# EAGLE design BallLamp (EAGLE 7.5.0)
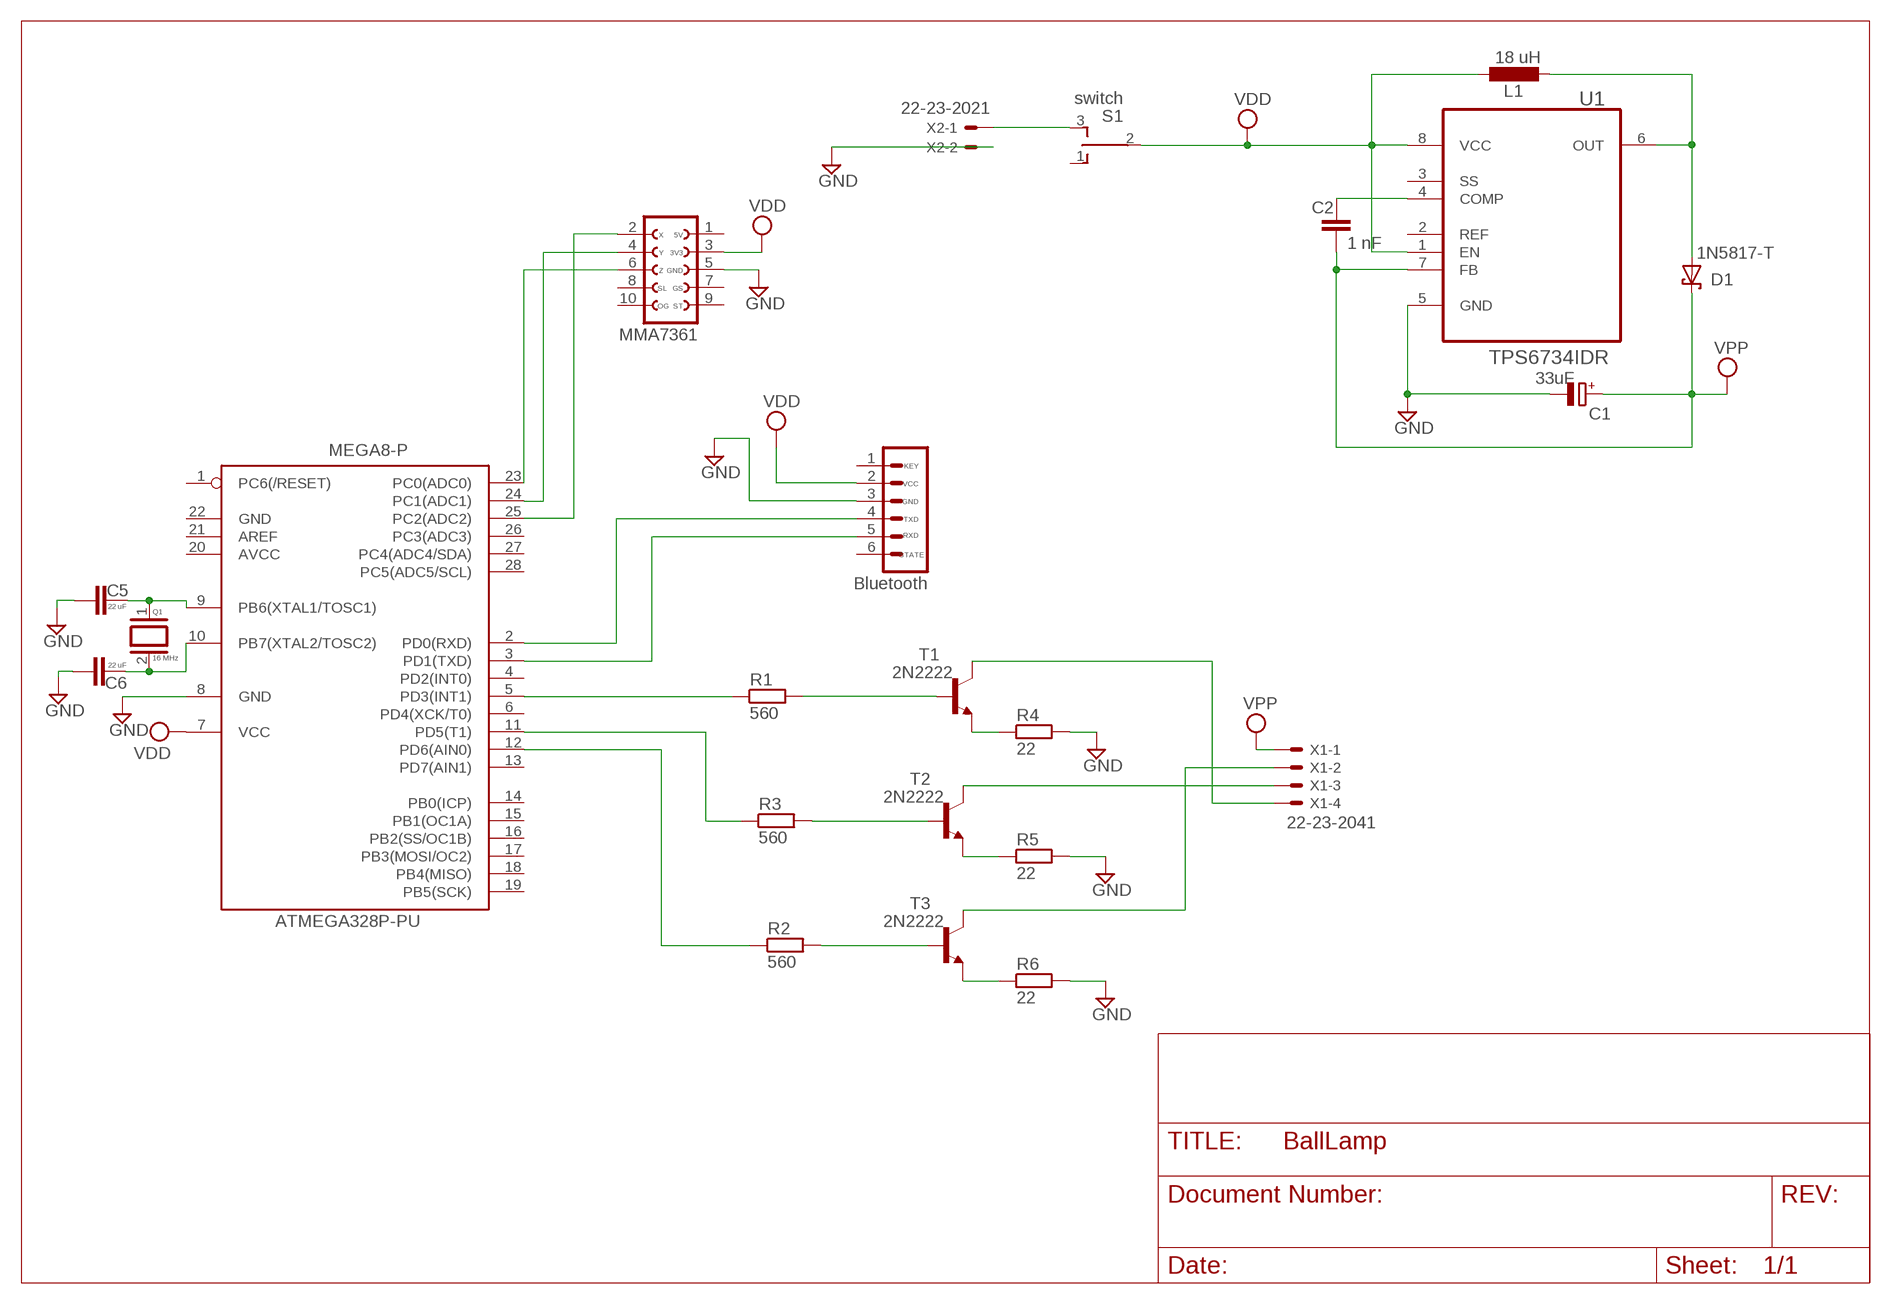
[diagram p0: schematic, sheet 1]

## Parts
ATMEGA328P-PU  MEGA8-P  [DIL28-3]
BLUETOOTH  M06  [06P]
C1  33uF  CPOL-EUE5-5  [E5-5]
C2  1 nF  C-EU025-025X050  [C025-025X050]
C5  22 uF  C-EU050-024X044  [C050-024X044]
C6  22 uF  C-EU050-024X044  [C050-024X044]
D1  1N5817-T  [DO41-7.6]
L1  18 uH  L-EU0207/10  [0207/10]
Q1  16 MHz  XTAL/S  [QS]
R1  560  R-EU_0207/10  [0207/10]
R2  560  R-EU_0207/10  [0207/10]
R3  560  R-EU_0207/10  [0207/10]
R4  22  R-EU_0207/10  [0207/10]
R5  22  R-EU_0207/10  [0207/10]
R6  22  R-EU_0207/10  [0207/10]
S1  switch  TL39PO  [TL3XPO]
SV1  FE05-2  [FE05-2]
T1  2N2222  [TO18]
T2  2N2222  [TO18]
T3  2N2222  [TO18]
U1  TPS6734IDR  [SOIC127P600X175-8N]
X1  22-23-2041  [22-23-2041]
X2  22-23-2021  [22-23-2021]

## Nets
+12V: C1.+ C2.2 D1.C U1.7(FB) X1.1 ; supply symbol labelled VPP
GND: ATMEGA328P-PU.8(GND) BLUETOOTH.3 C1.- C5.1 C6.1 R4.2 R5.2 R6.2 SV1.5(GND) U1.5(GND) X2.2
N$1: ATMEGA328P-PU.2(PD0(RXD)) BLUETOOTH.4
N$2: ATMEGA328P-PU.3(PD1(TXD)) BLUETOOTH.5
N$3: ATMEGA328P-PU.23(PC0(ADC0)) SV1.6(Z)
N$4: ATMEGA328P-PU.24(PC1(ADC1)) SV1.4(Y)
N$5: ATMEGA328P-PU.25(PC2(ADC2)) SV1.2(X)
N$6: ATMEGA328P-PU.5(PD3(INT1)) R1.1
N$7: ATMEGA328P-PU.12(PD6(AIN0)) R2.1
N$8: ATMEGA328P-PU.11(PD5(T1)) R3.1
N$9: R1.2 T1.2(B)
N$10: R3.2 T2.2(B)
N$11: R6.1 T3.1(E)
N$12: R2.2 T3.2(B)
N$13: R5.1 T2.1(E)
N$14: R4.1 T1.1(E)
N$15: T1.3(C) X1.4
N$16: T3.3(C) X1.2
N$17: T2.3(C) X1.3
N$19: D1.A L1.2 U1.6(OUT)
N$20: S1.3(S) X2.1
N$21: C2.1 U1.4(COMP)
N$22: ATMEGA328P-PU.10(PB7(XTAL2/TOSC2)) C6.2 Q1.2
N$23: ATMEGA328P-PU.9(PB6(XTAL1/TOSC1)) C5.2 Q1.1
VDD: ATMEGA328P-PU.7(VCC) BLUETOOTH.2 L1.1 S1.2(P) SV1.3(3V3) U1.1(EN) U1.8(VCC)
Unconnected: ATMEGA328P-PU.1(PC6(/RESET)) ATMEGA328P-PU.4(PD2(INT0)) ATMEGA328P-PU.6(PD4(XCK/T0)) ATMEGA328P-PU.13(PD7(AIN1)) ATMEGA328P-PU.14(PB0(ICP)) ATMEGA328P-PU.15(PB1(OC1A)) ATMEGA328P-PU.16(PB2(SS/OC1B)) ATMEGA328P-PU.17(PB3(MOSI/OC2)) ATMEGA328P-PU.18(PB4(MISO)) ATMEGA328P-PU.19(PB5(SCK)) ATMEGA328P-PU.21(AREF) ATMEGA328P-PU.26(PC3(ADC3)) ATMEGA328P-PU.27(PC4(ADC4/SDA)) ATMEGA328P-PU.28(PC5(ADC5/SCL)) BLUETOOTH.1 BLUETOOTH.6 S1.1(O) SV1.1(5V) SV1.7(GS) SV1.8(SL) SV1.9(ST) SV1.10(OG) U1.2(REF) U1.3(SS)

## Power pins joined to a net without a drawn wire
AVCC: ATMEGA328P-PU.20(AVCC)
GND: ATMEGA328P-PU.22(GND)

## Library data of the parts
ATMEGA328P-PU = atmel:MEGA8-P: MICROCONTROLLER 8 Kbytes FLASH, 1 kbytes SRAM, 512 bytes EEPROM, USART, 4-channel 10 bit ADC, 2-channel 8 bit ADC Pin compatible with Atmega48, ATMega88, ATMega168 Source: avr.lbr; OC_FARNELL: unknown; OC_NEWARK: unknown
BLUETOOTH = Bluetooth:M06: AMP QUICK CONNECTOR; OC_FARNELL: unknown; OC_NEWARK: unknown
C1 = rcl:CPOL-EU: POLARIZED CAPACITOR, European symbol
C2 C5 C6 = rcl:C-EU: CAPACITOR, European symbol
D1 = diode:1N581*: 1.0A SCHOTTKY BARRIER RECTIFIER Source: http://www.diodes.com/datasheets/ds23001.pdf
L1 = rcl:L-EU: INDUCTOR, European symbol
Q1 = special:XTAL/S: CRYSTAL
R1-R6 = resistor:R-EU_: RESISTOR, European symbol
S1 = switch:TL39PO: TINY SWITCH ON OFF ON Source: http://www2.produktinfo.conrad.com/datenblaetter/700000-724999/705152-da-01-de-Subminiaturschalter_TL_36YO.pdf
SV1 = con-lsta:FE05-2: FEMALE HEADER; OC_FARNELL: unknown; OC_NEWARK: unknown
T1-T3 = transistor:2N2222: NPN TRANSISTOR
U1 = TI-TPS6734IDR:TPS6734IDR: BOOST-CONVERTER SUPPLY; MPN: TPS6734IDR; OC_FARNELL: 1575732; OC_NEWARK: 77C0735; PACKAGE: SOIC-8; SUPPLIER: Texas Instruments
X1 = con-molex:22-23-2041: .100" (2.54mm) Center Header - 4 Pin; MF: MOLEX; MPN: 22-23-2041; OC_FARNELL: 1462920; OC_NEWARK: 38C0355
X2 = con-molex:22-23-2021: .100" (2.54mm) Center Header - 2 Pin; MF: MOLEX; MPN: 22-23-2021; OC_FARNELL: 1462926; OC_NEWARK: 25C3832

## Board
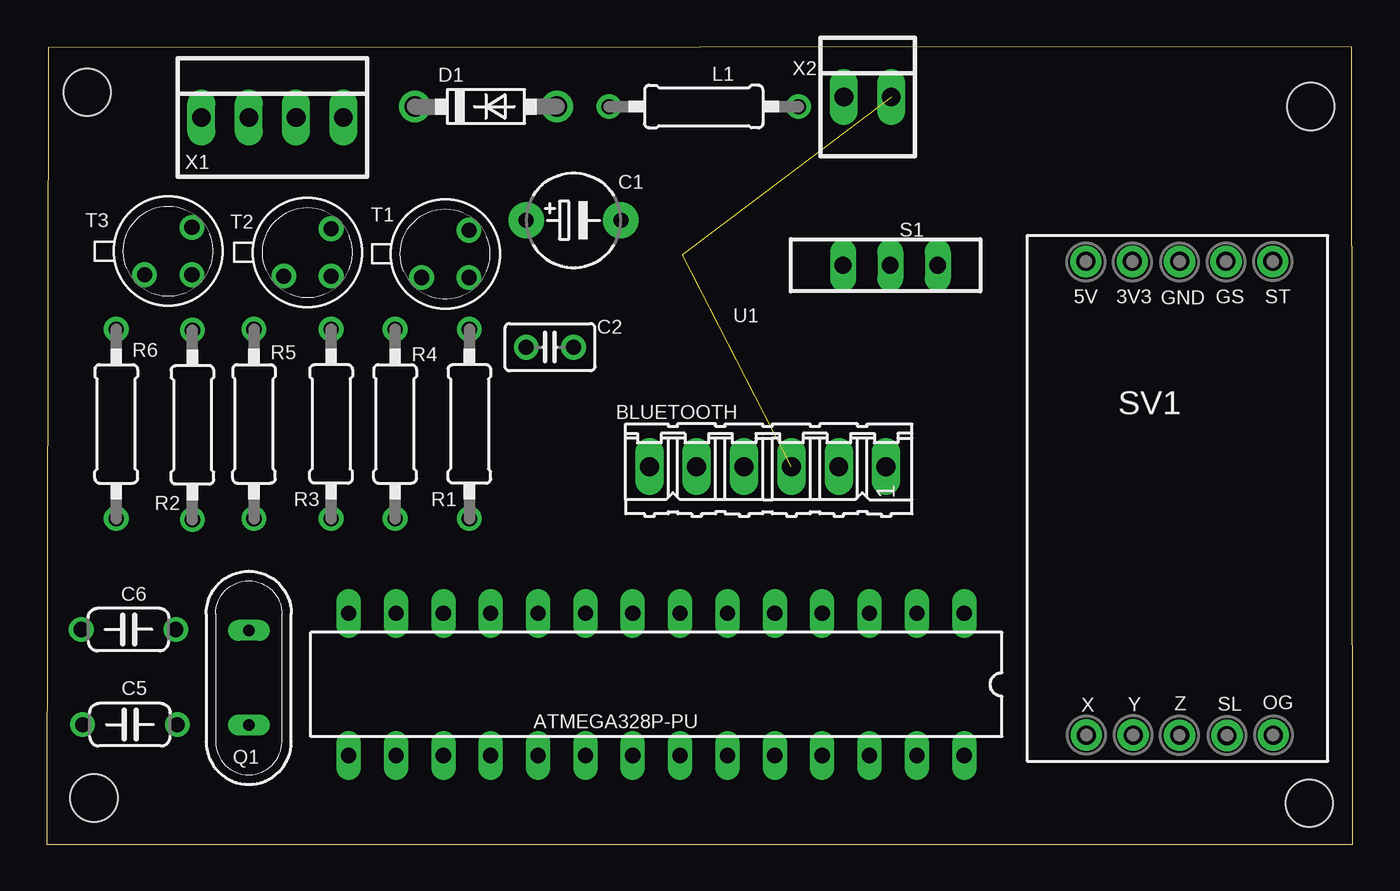
[diagram p1: board, top side]
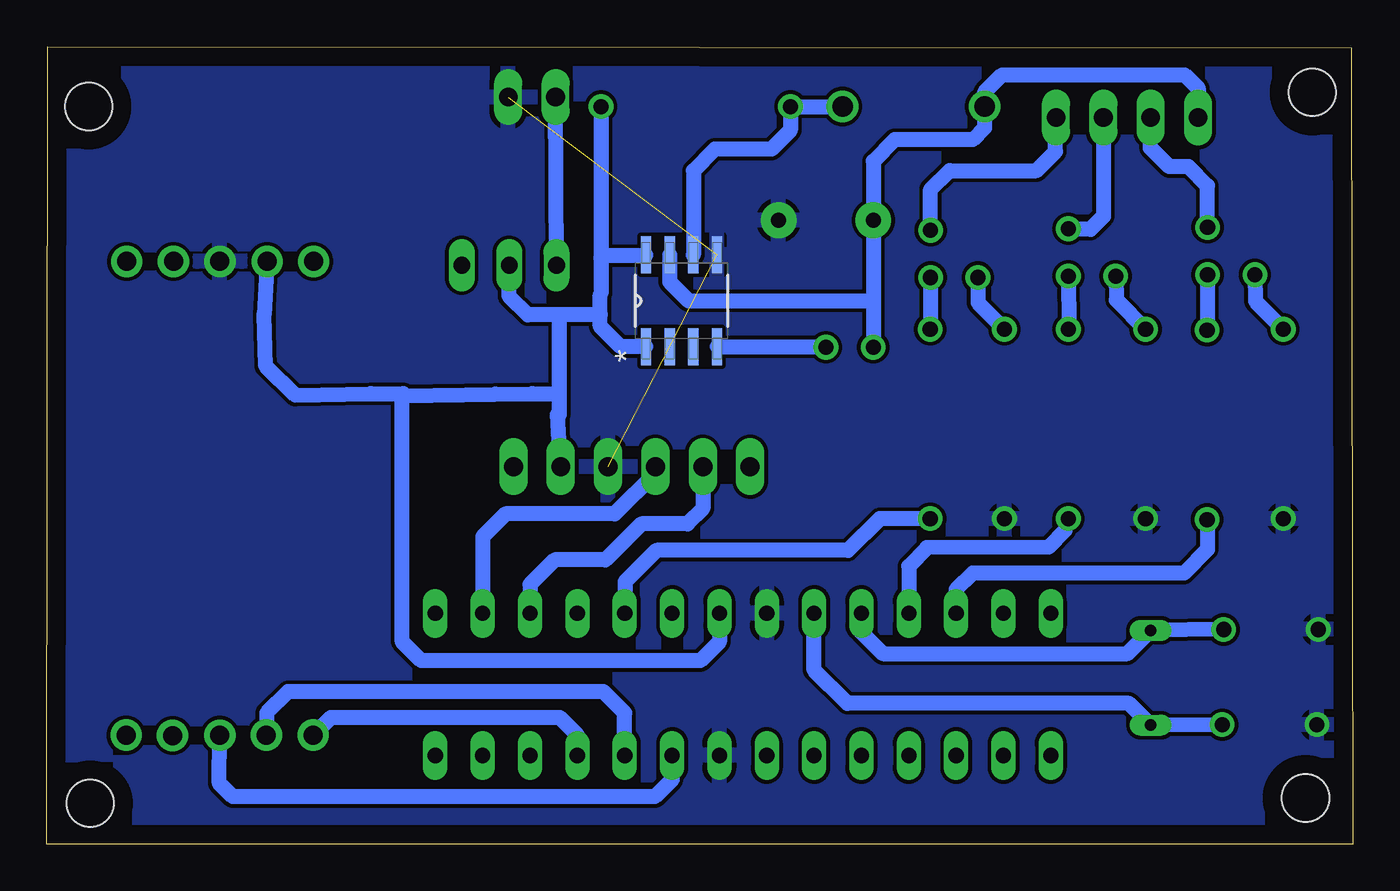
[diagram p2: board, bottom side, seen from below]

Size 70.08 x 42.76 mm. Coordinates in mm from the lower left corner, seen from the top.
Outline: 0,0 70.08,0 70.03,42.76 0.08,42.71 0,0
Copper layers (1*16): Top 0.035mm / dielectric 1.5mm / Bottom 0.035mm
Design rules "default": minimum track width 10mil, minimum drill 24mil, track to track 8mil, track to pad 8mil, pad to pad 8mil, via to via 8mil, smd to smd 8mil, copper to edge 40mil, drill to drill 8mil, minimum pad ring 10mil, minimum via ring 8mil, stop-mask expansion 4mil, vias tented up to drill 0mil, thermal gap 10mil
Holes 2.54 mm at 2.54,2.46 67.74,2.18 2.18,40.31 67.82,39.55

### Footprints (pad centres in the part's own frame; a part is rotated, then mirrored left to right if it is on the bottom)
DIL28-3 = drill 0.813 long: 1 -16.51,-3.81; 2 -13.97,-3.81; 3 -11.43,-3.81; 4 -8.89,-3.81; 5 -6.35,-3.81; 6 -3.81,-3.81; 7 -1.27,-3.81; 8 1.27,-3.81; 9 3.81,-3.81; 10 6.35,-3.81; 11 8.89,-3.81; 12 11.43,-3.81; 13 13.97,-3.81; 14 16.51,-3.81; 15 16.51,3.81; 16 13.97,3.81; 17 11.43,3.81; 18 8.89,3.81; 19 6.35,3.81; 20 3.81,3.81; 21 1.27,3.81; 22 -1.27,3.81; 23 -3.81,3.81; 24 -6.35,3.81; 25 -8.89,3.81; 26 -11.43,3.81; 27 -13.97,3.81; 28 -16.51,3.81
06P = drill 1.016 long: 1 -6.35,0; 2 -3.81,0; 3 -1.27,0; 4 1.27,0; 5 3.81,0; 6 6.35,0
E5-5 = drill 0.813 pad 1.905: + -2.54,0; - 2.54,0
C025-025X050 = drill 0.813: 1 -1.27,0; 2 1.27,0
C050-024X044 = drill 0.813: 1 -2.54,0; 2 2.54,0
DO41-7.6 = drill 1.1 pad 1.7: A 3.81,0; C -3.81,0
0207/10 = drill 0.813: 1 -5.08,0; 2 5.08,0
QS = drill 0.61 long: 1 -2.54,0; 2 2.54,0
TL3XPO = drill 0.889 pad 1.016 long: 1 -2.794,1.143; 2 -0.254,1.143; 3 2.286,1.143
FE05-2 = drill 1.016 pad 1.676: 1 -3.581,13.589; 2 -3.556,-11.811; 3 -1.092,13.589; 4 -1.041,-11.811; 5 1.448,13.589; 6 1.448,-11.824; 7 3.937,13.589; 8 3.988,-11.836; 9 6.452,13.589; 10 6.477,-11.811
TO18 = drill 0.813: 1 -1.27,-1.27; 2 1.27,-1.27; 3 1.27,1.27
SOIC127P600X175-8N = smd 1.981 x 0.559: 1 -2.464,1.905; 2 -2.464,0.635; 3 -2.464,-0.635; 4 -2.464,-1.905; 5 2.464,-1.905; 6 2.464,-0.635; 7 2.464,0.635; 8 2.464,1.905
22-23-2041 = drill 1 long: 1 -3.81,0; 2 -1.27,0; 3 1.27,0; 4 3.81,0
22-23-2021 = drill 1 long: 1 -1.27,0; 2 1.27,0

### Placement (x,y rotation side)
ATMEGA328P-PU  32.72,8.56 180 top
BLUETOOTH  38.68,20.24 180 top
C1  28.27,33.45 0 top
C2  27,26.64 180 top
C5  4.47,6.4 0 top
C6  4.39,11.51 0 top
D1  23.57,39.55 0 top
L1  35.26,39.55 180 top
Q1  10.85,8.92 90 top
R1  22.68,22.53 90 top
R2  7.82,22.48 90 top
R3  15.27,22.53 90 top
R4  18.69,22.53 270 top
R5  11.13,22.53 270 top
R6  3.73,22.53 270 top
S1  45.01,32.18 180 top
SV1  59.33,17.65 0 top
T1  21.39,31.65 0 top
T2  14,31.72 0 top
T3  6.53,31.8 0 top
U1  36.02,29.13 90 bottom
X1  12.12,38.96 0 top
X2  44.04,40.06 0 top

### Tracks (layer width: path | path; a pad name or v marks a point on that pad's centre or on a via)
+12V
  Bottom 0.813: 25.73,29.01 C1.+ 25.73,36.63 24.59,37.77 20.4,37.77 19.76,38.4 D1.C 19.76,40.31 18.82,41.25 9.02,41.25 8.31,40.54 X1.1 | 25.73,29.01 C2.2 | U1.7 36.65,30.15 35.64,29.13 25.86,29.13 25.73,29.01
GND  (2 unrouted)
  pour Bottom: 0.2,43.46 70.1,43.46 70.1,0.3 0.2,0.3
N$1
  Bottom 0.813: BLUETOOTH.4 37.41,19.89 39.6,17.7 45.47,17.7 46.69,16.48 ATMEGA328P-PU.2
N$2
  Bottom 0.813: BLUETOOTH.5 34.87,17.98 35.69,17.17 38.18,17.17 40.11,15.24 42.82,15.24 44.15,13.92 ATMEGA328P-PU.3
N$3
  Bottom 0.813: ATMEGA328P-PU.23 36.53,3.45 37.44,2.54 60.1,2.54 60.81,3.25 SV1.6
N$4
  Bottom 0.813: ATMEGA328P-PU.24 39.07,7.04 40.21,8.18 57.12,8.18 58.27,7.04 SV1.4
N$5
  Bottom 0.813: ATMEGA328P-PU.25 41.61,5.84 42.55,6.78 54.84,6.78 SV1.2
N$6
  Bottom 0.813: R1.1 25.37,17.45 27.08,15.75 37.36,15.75 39.04,14.07 39.04,12.39 ATMEGA328P-PU.5
N$7
  Bottom 0.813: R2.1 7.8,15.8 9.07,14.53 20.4,14.53 21.29,13.64 ATMEGA328P-PU.12
N$8
  Bottom 0.813: R3.1 15.44,16.81 16.33,15.93 22.86,15.9 23.83,14.91 ATMEGA328P-PU.11
N$9
  Bottom 0.813: T1.2 22.66,27.63 R1.2
N$10
  Bottom 0.813: T2.2 15.24,27.74 R3.2
N$11
  Bottom 0.813: T3.1 5.23,29.11 R6.1
N$12
  Bottom 0.813: T3.2 7.8,27.58 R2.2
N$13
  Bottom 0.813: T2.1 12.7,29.18 R5.1
N$14
  Bottom 0.813: T1.1 20.12,29.03 R4.1
N$15
  Bottom 0.813: T1.3 22.66,35.1 21.64,36.12 16.97,36.12 15.95,37.13 X1.4
N$16
  Bottom 0.813: T3.3 7.8,35.31 8.81,36.32 9.86,36.32 10.87,37.34 X1.2
N$17
  Bottom 0.813: X1.3 13.39,33.65 14.07,32.97 15.24,32.97 T2.3
N$19
  Bottom 0.813: D1.A L1.2 30.18,38.28 31.19,37.26 34.24,37.26 35.38,36.12 U1.6
N$20
  Bottom 0.813: S1.3 X2.1
N$21
  Bottom 0.813: U1.4 28.3,26.67 C2.1
N$22
  Bottom 0.813: C6.2 Q1.2 12.09,10.21 25.22,10.21 26.37,11.35 ATMEGA328P-PU.10
N$23
  Bottom 0.813: C5.2 Q1.1 12.01,7.54 27.13,7.54 28.91,9.32 ATMEGA328P-PU.9
VDD
  Bottom 0.813: SV1.3 58.42,28.4 58.32,25.63 56.74,24.08 52.68,24.16 50.93,24.16 51,24.05 | BLUETOOTH.2 42.67,23.04 42.57,23.04 42.57,24.16 | ATMEGA328P-PU.7 33.99,10.85 35,9.83 49.99,9.83 51,10.85 51,24.05 | 51,24.05 46,24.13 44.02,24.16 42.57,24.16 | L1.1 40.34,31.42 | 40.34,31.42 40.34,29.51 40.39,29.46 40.39,28.4 | U1.8 37.97,31.55 40.21,31.55 40.34,31.42 | 42.57,28.37 40.41,28.37 40.39,28.4 | 42.57,28.37 44.27,28.37 45.26,29.36 S1.2 | U1.1 39.29,26.67 40.39,27.76 40.39,28.4 | 42.57,24.16 42.57,28.37